# Altium schematic sheet Temperature Sensors.SchDoc
size A; SheetNumber: 16; SheetTotal: 19
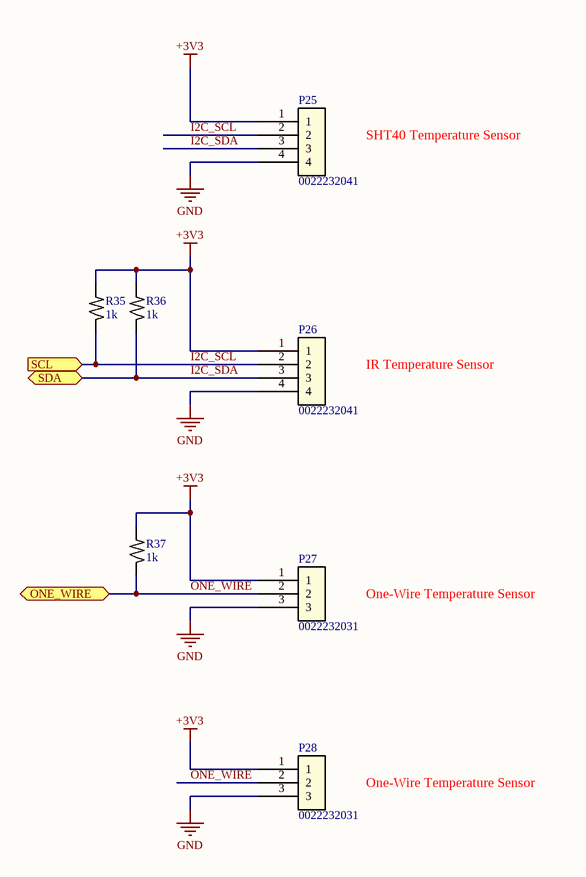
[diagram p0: Temperature Sensors.SchDoc]

## Parts
P25  0022232041  [Signal4]
P26  0022232041  [Signal4]
P27  0022232031  [Signal3]
P28  0022232031  [Signal3]
R35  1k  [R0603]
R36  1k  [R0603]
R37  1k  [R0603]

## Ports
ONE_WIRE (bidir), SCL (in), SDA (bidir)

## Nets
+3V3: P25.1 P26.1 P27.1 P28.1 R35.1 R36.1 R37.1
GND: P25.4 P26.4 P27.3 P28.3
I2C_SCL: P25.2 P26.2 R35.2 ; port SCL
I2C_SDA: P25.3 P26.3 R36.2 ; port SDA
ONE_WIRE: P27.2 P28.2 R37.2 ; port ONE_WIRE

## Notes on the sheet
- SHT40 Temperature Sensor
- IR Temperature Sensor
- One-Wire Temperature Sensor
- Project:
- Sheet Title:
- Size
- Date:
- A
- Sheet Number:
- Sheet Total:
- Revision:
- Time:
- Author:

## Library data of the parts
P25 P26 = Signal4: SignalConnector, 4 leads; MF: Molex; ComponentLink1Description: Datasheet; ComponentLink1URL: https://tools.molex.com/pdm_docs/ps/PS-10-07-001.pdf; ComponentLink2Description: Supplier1; ComponentLink2URL: https://www.digikey.com/en/products/detail/molex/0022232041/26671; MP: 0022232041
P27 P28 = Signal3: SignalConnector, 3 leads; MF: Molex; MP: 0022232031; ComponentLink1Description: Datasheet; ComponentLink1URL: https://tools.molex.com/pdm_docs/sd/022232031_sd.pdf; ComponentLink2Description: Supplier1; ComponentLink2URL: https://www.digikey.com/en/products/detail/molex/0022232031/26669
R35-R37 = Res: RES 1kΩ ±5% 100mW 0603; MF: VO; MP: SCR0603J1K; ComponentLink1Description: Datasheet; ComponentLink1URL: https://www.lcsc.com/datasheet/C3017736.pdf; ComponentLink2Description: Supplier1; ComponentLink2URL: https://www.lcsc.com/product-detail/C3017736.html